# EAGLE design Main_Board (EAGLE 6.4)
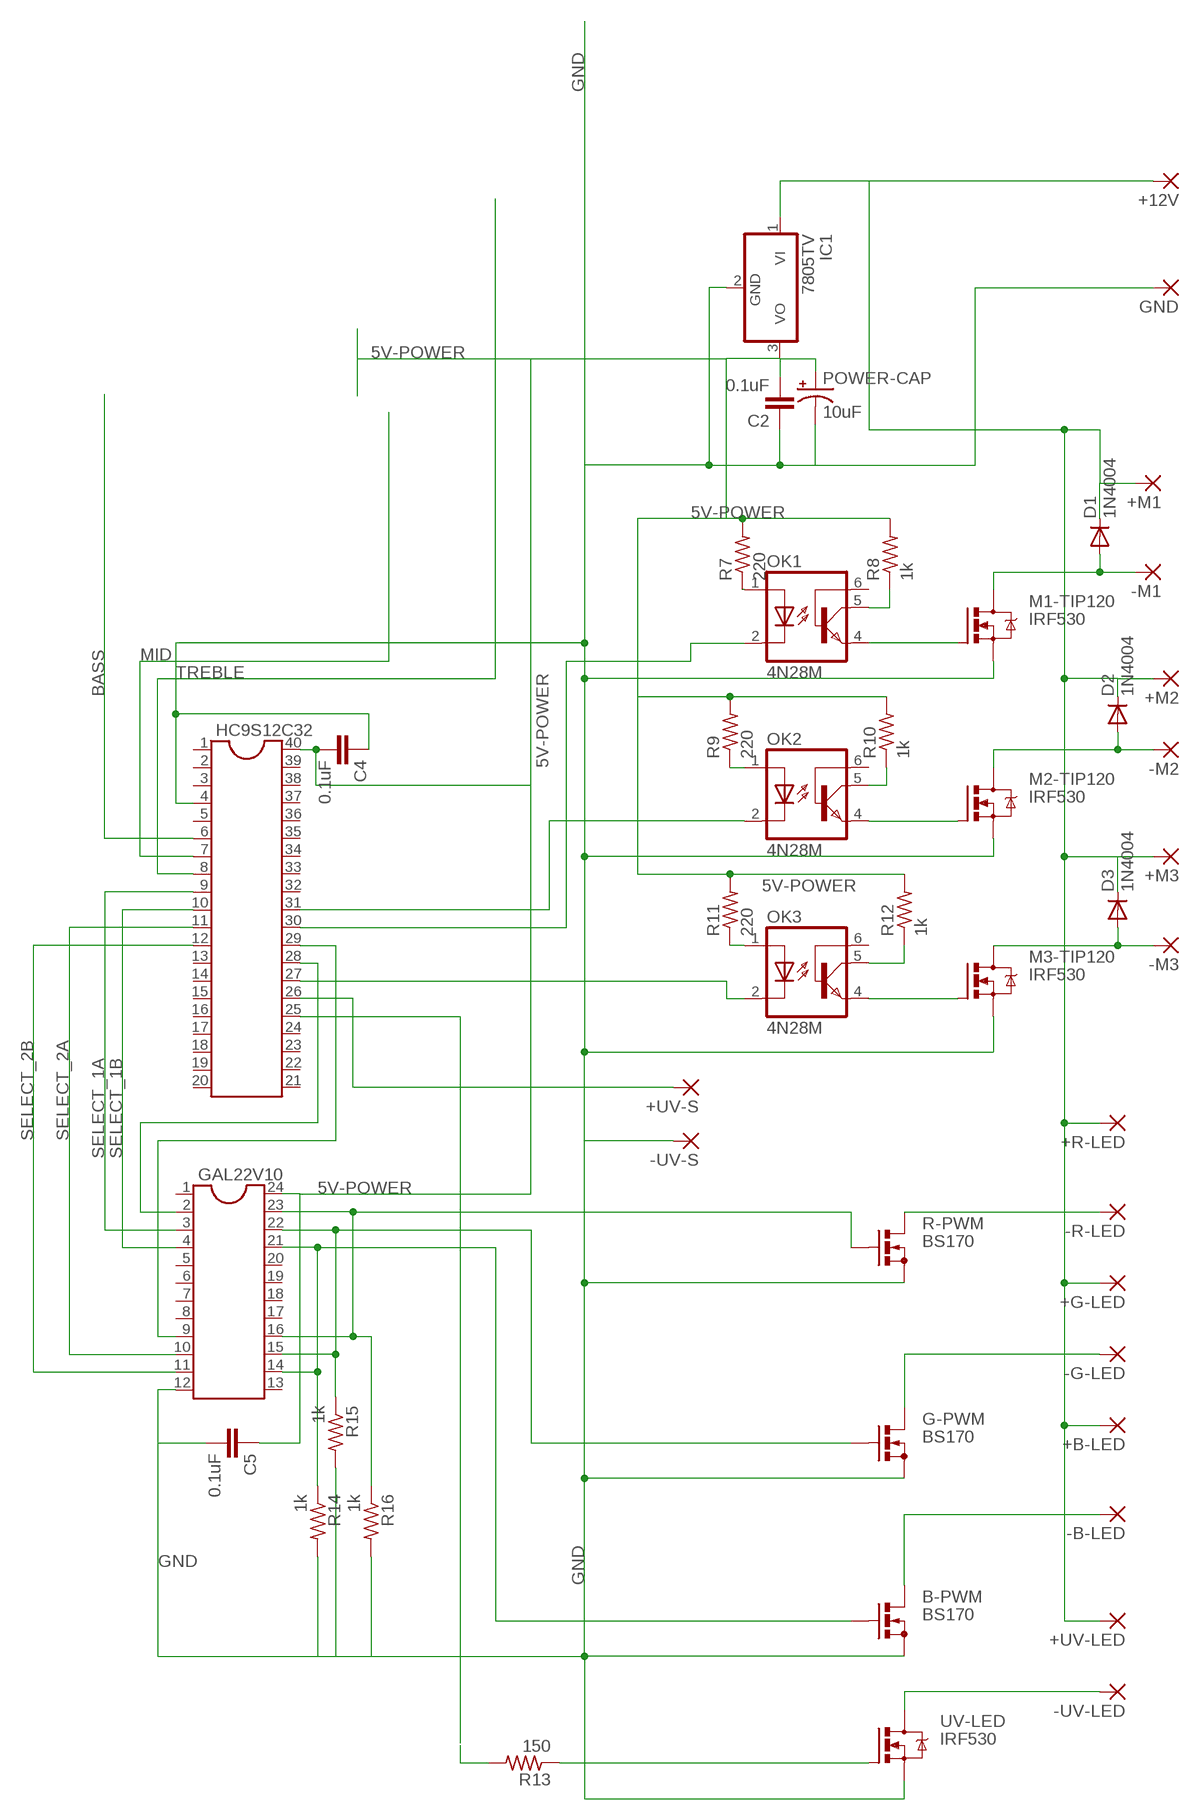
[diagram p0: schematic, sheet 1]

## Parts
+12V  3,81/1,4  [3,81/1,4]
+B-LED  3,81/1,4  [3,81/1,4]
+G-LED  3,81/1,4  [3,81/1,4]
+M1  3,81/1,4  [3,81/1,4]
+M2  3,81/1,4  [3,81/1,4]
+M3  3,81/1,4  [3,81/1,4]
+R-LED  3,81/1,4  [3,81/1,4]
+UV-LED  3,81/1,4  [3,81/1,4]
+UV-S  3,81/1,4  [3,81/1,4]
-B-LED  3,81/1,4  [3,81/1,4]
-G-LED  3,81/1,4  [3,81/1,4]
-M1  3,81/1,4  [3,81/1,4]
-M2  3,81/1,4  [3,81/1,4]
-M3  3,81/1,4  [3,81/1,4]
-R-LED  3,81/1,4  [3,81/1,4]
-UV-LED  3,81/1,4  [3,81/1,4]
-UV-S  3,81/1,4  [3,81/1,4]
B-PWM  BS170  [SOT54E]
C2  0.1uF  C7.5/6  [C7.5B6]
C4  0.1uF  C7.5/6  [C7.5B6]
C5  0.1uF  C7.5/6  [C7.5B6]
D1  1N4004  [DO41-10]
D2  1N4004  [DO41-10]
D3  1N4004  [DO41-10]
G-PWM  BS170  [SOT54E]
GAL22V10  DIL24-3  [DIL24-3]
GND  3,81/1,4  [3,81/1,4]
HC9S12C32  DIL40  [DIL40]
IC1  7805TV  [TO220V]
M1-TIP120  IRF530  [TO220BV]
M2-TIP120  IRF530  [TO220BV]
M3-TIP120  IRF530  [TO220BV]
OK1  4N28M  [DIL06]
OK2  4N28M  [DIL06]
OK3  4N28M  [DIL06]
POWER-CAP  10uF  CPOL-USTT5D10  [TT5D10]
R7  220  R-US_V234/12  [V234/12]
R8  1k  R-US_V234/12  [V234/12]
R9  220  R-US_V234/12  [V234/12]
R10  1k  R-US_V234/12  [V234/12]
R11  220  R-US_V234/12  [V234/12]
R12  1k  R-US_V234/12  [V234/12]
R13  150  R-US_V234/12  [V234/12]
R14  1k  R-US_V234/12  [V234/12]
R15  1k  R-US_V234/12  [V234/12]
R16  1k  R-US_V234/12  [V234/12]
R-PWM  BS170  [SOT54E]
UV-LED  IRF530  [TO220BV]

## Nets
5V-POWER: C2.2 C4.2 C5.1 GAL22V10.24 HC9S12C32.40 IC1.3(VO) POWER-CAP.+ R7.2 R8.2 R9.2 R10.2 R11.2 R12.2
12V-POWER: +12V.1(P) +B-LED.1(P) +G-LED.1(P) +M1.1(P) +M2.1(P) +M3.1(P) +R-LED.1(P) +UV-LED.1(P) D1.C D2.C D3.C IC1.1(VI)
B-CHANNEL: B-PWM.G GAL22V10.14 GAL22V10.21 R14.1
B-PWM: -B-LED.1(P) B-PWM.D
BASS: HC9S12C32.6
G-CHANNEL: G-PWM.G GAL22V10.15 GAL22V10.22 R15.1
GND: -UV-S.1(P) B-PWM.S C2.1 C4.1 C5.2 G-PWM.S GAL22V10.12 GND.1(P) HC9S12C32.4 IC1.2(GND) M1-TIP120.S M2-TIP120.S M3-TIP120.S POWER-CAP.- R14.2 R15.2 R16.2 R-PWM.S UV-LED.S
LED1-PWM: GAL22V10.2 HC9S12C32.28
LED2-PWM: GAL22V10.9 HC9S12C32.29
M1-PWM: HC9S12C32.30 OK1.2(C)
M2-PWM: HC9S12C32.31 OK2.2(C)
M3-PWM: HC9S12C32.27 OK3.2(C)
MID: HC9S12C32.7
N$1: -UV-LED.1(P) UV-LED.D
N$2: HC9S12C32.25
N$3: R13.1 UV-LED.G
N$4: -G-LED.1(P) G-PWM.D
N$5: -R-LED.1(P) R-PWM.D
N$6: R13.2
N$7: M3-TIP120.G OK3.4(EMI)
N$8: +UV-S.1(P) HC9S12C32.26
N$13: M2-TIP120.G OK2.4(EMI)
N$14: OK2.5(COL) R10.1
N$15: OK1.5(COL) R8.1
N$16: M1-TIP120.G OK1.4(EMI)
N$18: -M1.1(P) D1.A M1-TIP120.D
N$20: -M2.1(P) D2.A M2-TIP120.D
N$21: OK3.5(COL) R12.1
N$23: -M3.1(P) D3.A M3-TIP120.D
N$24: OK2.1(A) R9.1
N$25: OK1.1(A) R7.1
N$26: OK3.1(A) R11.1
R-CHANNEL: GAL22V10.16 GAL22V10.23 R16.1 R-PWM.G
SELECT_1A: GAL22V10.3 HC9S12C32.9
SELECT_1B: GAL22V10.4 HC9S12C32.10
SELECT_2A: GAL22V10.10 HC9S12C32.11
SELECT_2B: GAL22V10.11 HC9S12C32.12
TREBLE: HC9S12C32.8
Unconnected: GAL22V10.1 GAL22V10.5 GAL22V10.6 GAL22V10.7 GAL22V10.8 GAL22V10.13 GAL22V10.17 GAL22V10.18 GAL22V10.19 GAL22V10.20 HC9S12C32.1 HC9S12C32.2 HC9S12C32.3 HC9S12C32.5 HC9S12C32.13 HC9S12C32.14 HC9S12C32.15 HC9S12C32.16 HC9S12C32.17 HC9S12C32.18 HC9S12C32.19 HC9S12C32.20 HC9S12C32.21 HC9S12C32.22 HC9S12C32.23 HC9S12C32.24 HC9S12C32.32 HC9S12C32.33 HC9S12C32.34 HC9S12C32.35 HC9S12C32.36 HC9S12C32.37 HC9S12C32.38 HC9S12C32.39 OK1.6(BAS) OK2.6(BAS) OK3.6(BAS)

## Library data of the parts
+12V +B-LED +G-LED +M1-+M3 +R-LED +UV-LED +UV-S -B-LED -G-LED -M1--M3 -R-LED -UV-LED -UV-S GND = wirepad:3,81/1,4: THROUGH-HOLE PAD
B-PWM G-PWM R-PWM = transistor-small-signal:BS170: N-CHANNEL MOS FET
C2 C4 C5 = capacitor-wima:C: CAPACITOR naming: grid - package width
D1-D3 = diode:1N4004: DIODE general purpose rectifier, 1 A
GAL22V10 = ic-package:DIL24: Dual In Line
HC9S12C32 = ic-package:DIL40: Dual In Line
IC1 = linear:78*: Positive VOLTAGE REGULATOR Source: http://cache.national.com/ds/LM/LM78L05.pdf http://www.fairchildsemi.com/ds/LM/LM7805.pdf
M1-TIP120 M2-TIP120 M3-TIP120 UV-LED = transistor-power:IRF530: HEXFET Power MOSFET
OK1-OK3 = optocoupler:4N*?M: General Purpose 6-Pin Phototransistor Optocouplers Source: http://www.fairchildsemi.com/ds/4N/4N35-M.pdf; MF: FAIRCHILD SEMICONDUCTOR; MPN: 4N28-M; OC_FARNELL: 1504445; OC_NEWARK: 05C3313
POWER-CAP = resistor:CPOL-US: POLARIZED CAPACITOR, American symbol
R7-R16 = rcl:R-US_: RESISTOR, American symbol

## Board
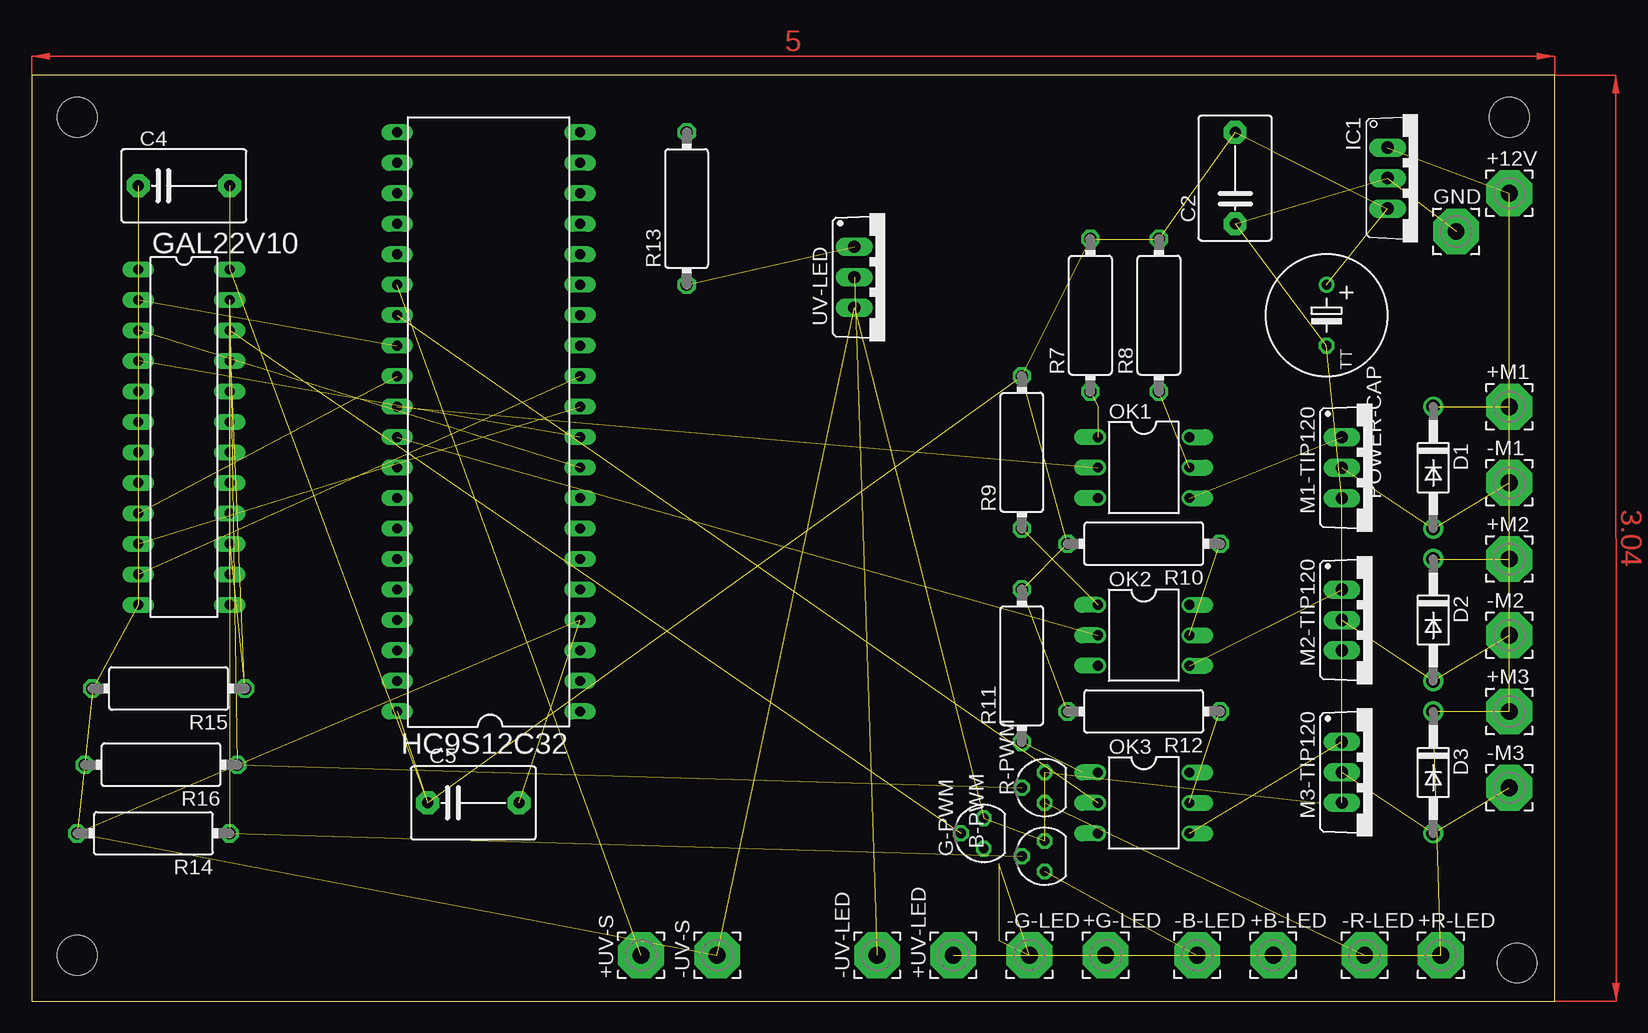
[diagram p1: board, top side]
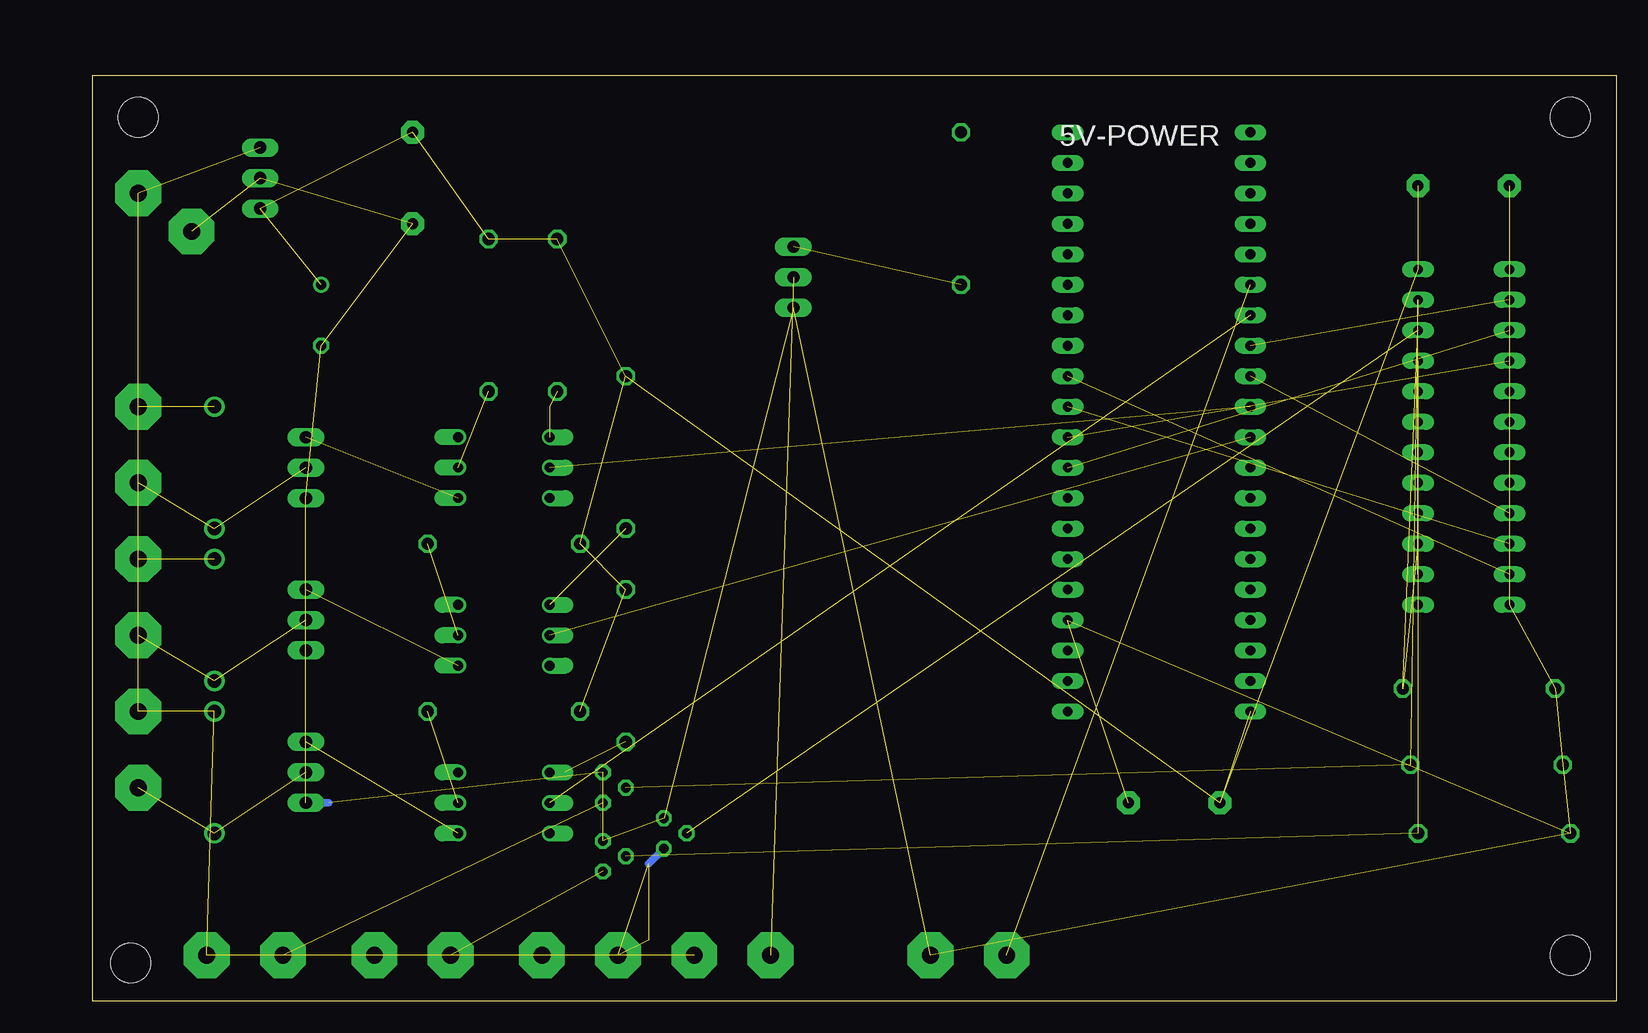
[diagram p2: board, bottom side, seen from below]

Size 126.98 x 77.14 mm. Coordinates in mm from the lower left corner, seen from the top.
Outline: 0,0 126.98,0 126.98,77.14 0,77.14 0,0
Copper layers (1*16): Top 0.035mm / dielectric 1.5mm / Bottom 0.035mm
Design rules "default": minimum track width 10mil, minimum drill 24mil, track to track 8mil, track to pad 8mil, pad to pad 8mil, via to via 8mil, smd to smd 8mil, copper to edge 40mil, drill to drill 8mil, minimum pad ring 10mil, minimum via ring 8mil, stop-mask expansion 4mil, vias tented up to drill 0mil, thermal gap 10mil

### Footprints (pad centres in the part's own frame; a part is rotated, then mirrored left to right if it is on the bottom)
3,81/1,4 = drill 1.397 pad 3.81 octagon: 1 0,0
SOT54E = drill 0.813 octagon: D -1.27,0; G 0,1.905; S 1.27,0
C7.5B6 = drill 0.914 pad 1.905 octagon: 1 -3.81,0; 2 3.81,0
DO41-10 = drill 1.118: A 5.08,0; C -5.08,0
DIL24-3 = drill 0.813 long: 1 -13.97,-3.81; 2 -11.43,-3.81; 3 -8.89,-3.81; 4 -6.35,-3.81; 5 -3.81,-3.81; 6 -1.27,-3.81; 7 1.27,-3.81; 8 3.81,-3.81; 9 6.35,-3.81; 10 8.89,-3.81; 11 11.43,-3.81; 12 13.97,-3.81; 13 13.97,3.81; 14 11.43,3.81; 15 8.89,3.81; 16 6.35,3.81; 17 3.81,3.81; 18 1.27,3.81; 19 -1.27,3.81; 20 -3.81,3.81; 21 -6.35,3.81; 22 -8.89,3.81; 23 -11.43,3.81; 24 -13.97,3.81
DIL40 = drill 0.813 long: 1 -24.13,-7.62; 2 -21.59,-7.62; 3 -19.05,-7.62; 4 -16.51,-7.62; 5 -13.97,-7.62; 6 -11.43,-7.62; 7 -8.89,-7.62; 8 -6.35,-7.62; 9 -3.81,-7.62; 10 -1.27,-7.62; 11 1.27,-7.62; 12 3.81,-7.62; 13 6.35,-7.62; 14 8.89,-7.62; 15 11.43,-7.62; 16 13.97,-7.62; 17 16.51,-7.62; 18 19.05,-7.62; 19 21.59,-7.62; 20 24.13,-7.62; 21 24.13,7.62; 22 21.59,7.62; 23 19.05,7.62; 24 16.51,7.62; 25 13.97,7.62; 26 11.43,7.62; 27 8.89,7.62; 28 6.35,7.62; 29 3.81,7.62; 30 1.27,7.62; 31 -1.27,7.62; 32 -3.81,7.62; 33 -6.35,7.62; 34 -8.89,7.62; 35 -11.43,7.62; 36 -13.97,7.62; 37 -16.51,7.62; 38 -19.05,7.62; 39 -21.59,7.62; 40 -24.13,7.62
TO220V = drill 1.016 long: 1 -2.54,-2.54; 2 0,-2.54; 3 2.54,-2.54
TO220BV = drill 1.016 long: D 0,-2.54; G -2.54,-2.54; S 2.54,-2.54
DIL06 = drill 0.813 offset: 1 -2.54,-3.81; 2 0,-3.81; 3 2.54,-3.81; 4 2.54,3.81; 5 0,3.81; 6 -2.54,3.81
TT5D10 = drill 0.813: + -2.54,0 | drill 0.813 octagon: - 2.54,0
V234/12 = drill 1.016 octagon: 1 -6.35,0; 2 6.35,0
STAND-OFF = hole 3.302: 0,0

### Placement (x,y rotation side)
+12V  123.19,67.31 0 top
+B-LED  103.5,3.81 0 top
+G-LED  89.53,3.81 0 top
+M1  123.19,49.53 0 top
+M2  123.19,36.83 0 top
+M3  123.19,24.13 0 top
+R-LED  117.47,3.81 0 top
+UV-LED  76.83,3.81 90 top
+UV-S  50.8,3.81 90 top
-B-LED  97.16,3.81 0 top
-G-LED  83.19,3.81 0 top
-M1  123.19,43.18 0 top
-M2  123.19,30.48 0 top
-M3  123.19,17.78 0 top
-R-LED  111.12,3.81 0 top
-UV-LED  70.48,3.81 90 top
-UV-S  57.15,3.81 90 top
B-PWM  84.45,12.06 90 top
C2  100.33,68.58 90 top
C4  12.7,67.94 0 top
C5  36.83,16.51 0 top
D1  116.84,44.45 270 top
D2  116.84,31.75 270 top
D3  116.84,19.05 270 top
G-PWM  79.38,13.97 90 top
GAL22V10  12.7,46.99 270 top
GND  118.75,64.14 0 top
HC9S12C32  38.1,48.26 90 top
IC1  115.57,68.58 270 top
M1-TIP120  111.76,44.45 270 top
M2-TIP120  111.76,31.75 270 top
M3-TIP120  111.76,19.05 270 top
OK1  92.71,44.45 270 top
OK2  92.71,30.48 270 top
OK3  92.71,16.51 270 top
POWER-CAP  107.95,57.15 270 top
R7  88.27,57.15 90 top
R8  93.98,57.15 90 top
R9  82.55,45.72 90 top
R10  92.71,38.1 180 top
R11  82.55,27.94 90 top
R12  92.71,24.13 180 top
R13  54.61,66.04 90 top
R14  10.16,13.97 180 top
R15  11.43,26.04 180 top
R16  10.79,19.68 180 top
R-PWM  84.45,17.78 90 top
U$1  [STAND-OFF]  123.83,3.17 0 top
U$2  [STAND-OFF]  3.81,3.81 0 top
U$3  [STAND-OFF]  123.19,73.66 0 top
U$4  [STAND-OFF]  3.81,73.66 0 top
UV-LED  71.12,60.33 270 top

### Tracks (layer width: path | path; a pad name or v marks a point on that pad's centre or on a via)
5V-POWER  (12 unrouted)
12V-POWER  (11 unrouted)
B-CHANNEL  (3 unrouted)
B-PWM  (1 unrouted)
G-CHANNEL  (3 unrouted)
GND  (18 unrouted)
  Bottom 0.61: 107.31,16.51 M3-TIP120.S
LED1-PWM  (1 unrouted)
LED2-PWM  (1 unrouted)
M1-PWM  (1 unrouted)
M2-PWM  (1 unrouted)
M3-PWM  (1 unrouted)
N$1  (1 unrouted)
N$3  (1 unrouted)
N$4  (3 unrouted)
  Bottom 0.61: G-PWM.D 80.64,11.43
N$5  (1 unrouted)
N$7  (1 unrouted)
N$8  (1 unrouted)
N$13  (1 unrouted)
N$14  (1 unrouted)
N$15  (1 unrouted)
N$16  (1 unrouted)
N$18  (2 unrouted)
N$20  (2 unrouted)
N$21  (1 unrouted)
N$23  (2 unrouted)
N$24  (1 unrouted)
N$25  (2 unrouted)
N$26  (1 unrouted)
  Bottom 0.61: 87.63,19.05 OK3.1
R-CHANNEL  (3 unrouted)
SELECT_1A  (1 unrouted)
SELECT_1B  (1 unrouted)
SELECT_2A  (1 unrouted)
SELECT_2B  (1 unrouted)
(copper drawn outside any net)
  shapes: Top area x2

### Text on the board
bPlace: 5V-POWER